# Altium schematic sheet zynq.SchDoc
size A3; SheetNumber: 2; SheetTotal: 5
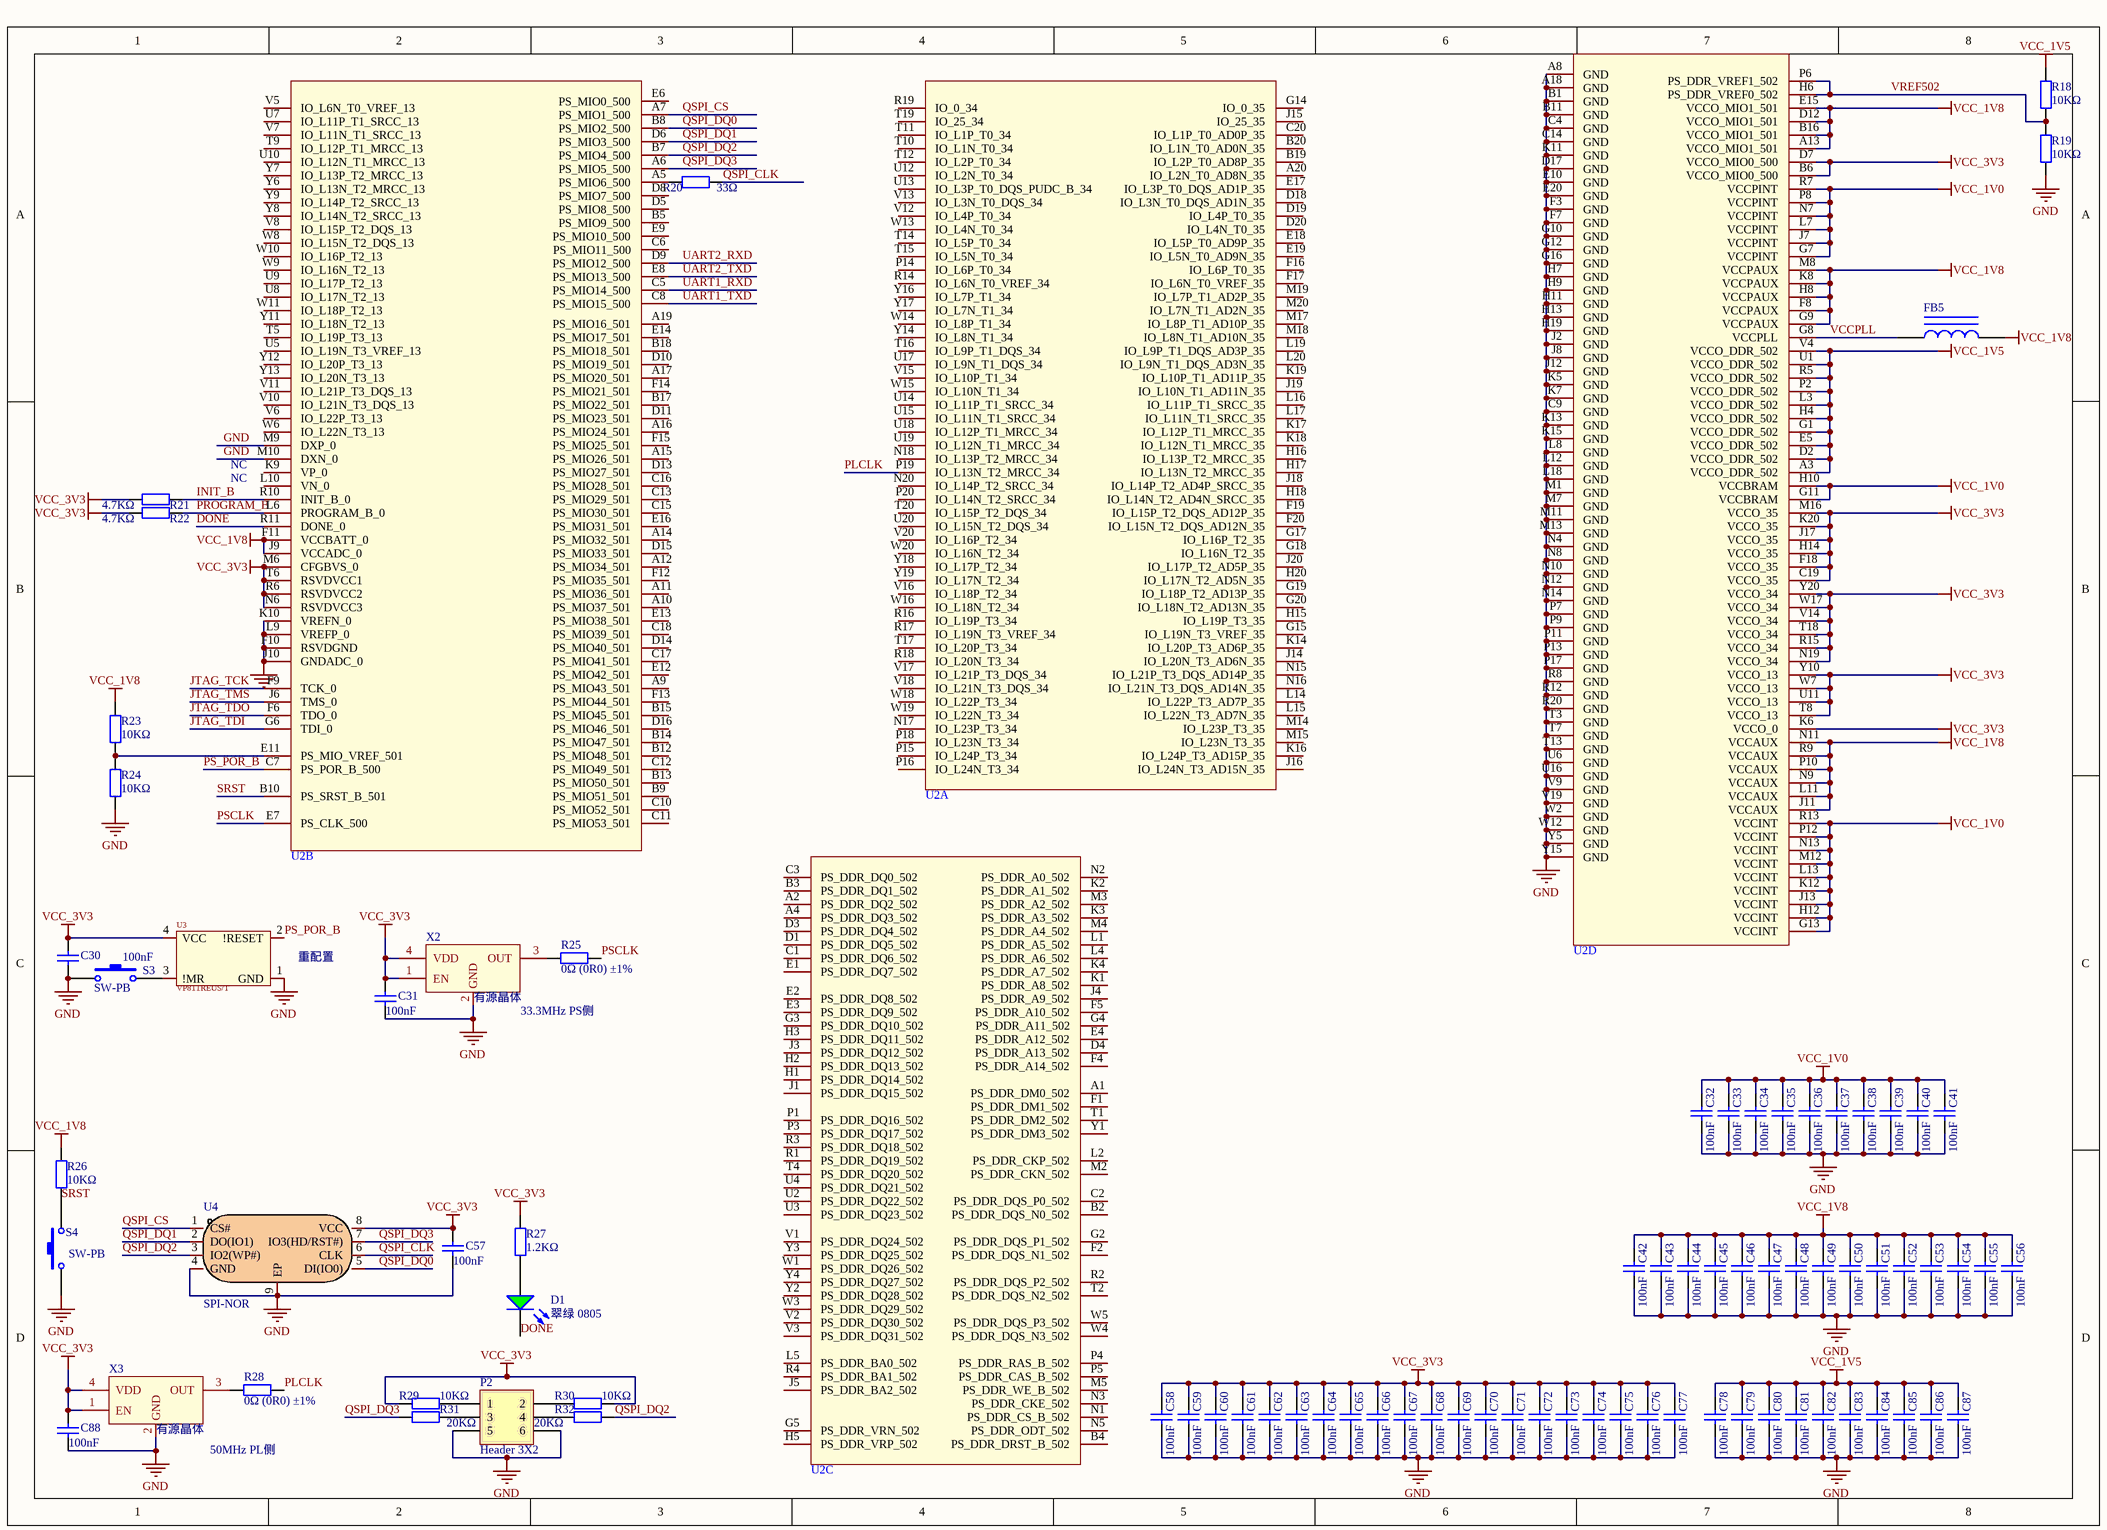
[diagram p0: zynq.SchDoc]

## Parts
C30  100nF  [0805_C]
C31  100nF  [0805_C]
C32  100nF  [0201]
C33  100nF  [0201]
C34  100nF  [0201]
C35  100nF  [0201]
C36  100nF  [0201]
C37  100nF  [0201]
C38  100nF  [0201]
C39  100nF  [0201]
C40  100nF  [0201]
C41  100nF  [0201]
C42  100nF  [0201]
C43  100nF  [0201]
C44  100nF  [0201]
C45  100nF  [0201]
C46  100nF  [0201]
C47  100nF  [0201]
C48  100nF  [0201]
C49  100nF  [0201]
C50  100nF  [0201]
C51  100nF  [0201]
C52  100nF  [0201]
C53  100nF  [0201]
C54  100nF  [0201]
C55  100nF  [0201]
C56  100nF  [0201]
C57  100nF  [0402_C]
C58  100nF  [0201]
C59  100nF  [0201]
C60  100nF  [0201]
C61  100nF  [0201]
C62  100nF  [0201]
C63  100nF  [0201]
C64  100nF  [0201]
C65  100nF  [0201]
C66  100nF  [0201]
C67  100nF  [0201]
C68  100nF  [0201]
C69  100nF  [0201]
C70  100nF  [0201]
C71  100nF  [0201]
C72  100nF  [0201]
C73  100nF  [0201]
C74  100nF  [0201]
C75  100nF  [0201]
C76  100nF  [0201]
C77  100nF  [0201]
C78  100nF  [0201]
C79  100nF  [0201]
C80  100nF  [0201]
C81  100nF  [0201]
C82  100nF  [0201]
C83  100nF  [0201]
C84  100nF  [0201]
C85  100nF  [0201]
C86  100nF  [0201]
C87  100nF  [0201]
C88  100nF  [0805_C]
D1  翠绿 0805  [0805_LED_S1]
FB5  100Ω ±25% 100MHz  [0805_L]  (value not drawn)
P2  Header 3X2  [HDR2X3]
R18  10KΩ  [0805_R]
R19  10KΩ  [0805_R]
R20  33Ω  [0402_R]
R21  4.7KΩ  [0805_R]
R22  4.7KΩ  [0805_R]
R23  10KΩ  [0805_R]
R24  10KΩ  [0805_R]
R25  0Ω (0R0) ±1%  [0805_R]
R26  10KΩ  [0805_R]
R27  1.2KΩ  [0805_R]
R28  0Ω (0R0) ±1%  [0805_R]
R29  10KΩ  [0402_R]
R30  10KΩ  [0402_R]
R31  20KΩ  [0402_R]
R32  20KΩ  [0402_R]
S3  SW-PB  [SW-3*4-2P]
S4  SW-PB  [SW-3*4-2P]
U2  XC7Z020-2CLG400I  [FBGA-400_L17.0-W17.0-R20-C20-P0.80-TL]  (value not drawn)  (parts A,B,C,D of 4)
U3  VP811REUS/T  [SOT-143_L2.9-W1.3-P1.92-LS2.3-BL]
U4  SPI-NOR  [WSON8]
X2  有源晶体  [3225]
X3  有源晶体  [3225]

## Nets
GND: C30.1 C31.1 C32.1 C33.1 C34.1 C35.1 C36.1 C37.1 C38.1 C39.1 C40.1 C41.1 C42.1 C43.1 C44.1 C45.1 C46.1 C47.1 C48.1 C49.1 C50.1 C51.1 C52.1 C53.1 C54.1 C55.1 C56.1 C57.1 C58.1 C59.1 C60.1 C61.1 C62.1 C63.1 C64.1 C65.1 C66.1 C67.1 C68.1 C69.1 C70.1 C71.1 C72.1 C73.1 C74.1 C75.1 C76.1 C77.1 C78.1 C79.1 C80.1 C81.1 C82.1 C83.1 C84.1 C85.1 C86.1 C87.1 C88.1 P2.5 P2.6 R19.1 R24.1 S3.1 S4.1 U2.A8(GND) U2.A18(GND) U2.B1(GND) U2.B11(GND) U2.C4(GND) U2.C9(GND) U2.C14(GND) U2.D17(GND) U2.E10(GND) U2.E20(GND) U2.F3(GND) U2.F7(GND) U2.F10(RSVDGND) U2.G10(GND) U2.G12(GND) U2.G16(GND) U2.H7(GND) U2.H9(GND) U2.H11(GND) U2.H13(GND) U2.H19(GND) U2.J2(GND) U2.J8(GND) U2.J10(GNDADC_0) U2.J12(GND) U2.K5(GND) U2.K7(GND) U2.K10(VREFN_0) U2.K11(GND) U2.K13(GND) U2.K15(GND) U2.L8(GND) U2.L9(VREFP_0) U2.L12(GND) U2.L18(GND) U2.M1(GND) U2.M7(GND) U2.M9(DXP_0) U2.M10(DXN_0) U2.M11(GND) U2.M13(GND) U2.N4(GND) U2.N8(GND) U2.N10(GND) U2.N12(GND) U2.N14(GND) U2.P7(GND) U2.P9(GND) U2.P11(GND) U2.P13(GND) U2.P17(GND) U2.R8(GND) U2.R12(GND) U2.R20(GND) U2.T3(GND) U2.T7(GND) U2.T13(GND) U2.U6(GND) U2.U16(GND) U2.V9(GND) U2.V19(GND) U2.W2(GND) U2.W12(GND) U2.Y5(GND) U2.Y15(GND) U3.1(GND) U4.4(GND) U4.9(EP) X2.2(GND) X3.2(GND)
VCC_1V0: C32.2 C33.2 C34.2 C35.2 C36.2 C37.2 C38.2 C39.2 C40.2 C41.2 U2.G7(VCCPINT) U2.G11(VCCBRAM) U2.G13(VCCINT) U2.H10(VCCBRAM) U2.H12(VCCINT) U2.J7(VCCPINT) U2.J13(VCCINT) U2.K12(VCCINT) U2.L7(VCCPINT) U2.L13(VCCINT) U2.M12(VCCINT) U2.N7(VCCPINT) U2.N13(VCCINT) U2.P8(VCCPINT) U2.P12(VCCINT) U2.R7(VCCPINT) U2.R13(VCCINT)
VCC_1V5: C78.2 C79.2 C80.2 C81.2 C82.2 C83.2 C84.2 C85.2 C86.2 C87.2 R18.2 U2.A3(VCCO_DDR_502) U2.D2(VCCO_DDR_502) U2.E5(VCCO_DDR_502) U2.G1(VCCO_DDR_502) U2.H4(VCCO_DDR_502) U2.L3(VCCO_DDR_502) U2.P2(VCCO_DDR_502) U2.R5(VCCO_DDR_502) U2.U1(VCCO_DDR_502) U2.V4(VCCO_DDR_502)
VCC_1V8: C42.2 C43.2 C44.2 C45.2 C46.2 C47.2 C48.2 C49.2 C50.2 C51.2 C52.2 C53.2 C54.2 C55.2 C56.2 FB5.2 R23.2 R26.2 U2.A13(VCCO_MIO1_501) U2.B16(VCCO_MIO1_501) U2.D12(VCCO_MIO1_501) U2.E15(VCCO_MIO1_501) U2.F8(VCCPAUX) U2.F11(VCCBATT_0) U2.G9(VCCPAUX) U2.H8(VCCPAUX) U2.J9(VCCADC_0) U2.J11(VCCAUX) U2.K8(VCCPAUX) U2.L11(VCCAUX) U2.M8(VCCPAUX) U2.N9(VCCAUX) U2.N11(VCCAUX) U2.P10(VCCAUX) U2.R9(VCCAUX)
VCC_3V3: C30.2 C31.2 C57.2 C58.2 C59.2 C60.2 C61.2 C62.2 C63.2 C64.2 C65.2 C66.2 C67.2 C68.2 C69.2 C70.2 C71.2 C72.2 C73.2 C74.2 C75.2 C76.2 C77.2 C88.2 R21.1 R22.1 R27.2 R29.1 R30.2 U2.B6(VCCO_MIO0_500) U2.C19(VCCO_35) U2.D7(VCCO_MIO0_500) U2.F18(VCCO_35) U2.H14(VCCO_35) U2.J17(VCCO_35) U2.K6(VCCO_0) U2.K20(VCCO_35) U2.M6(CFGBVS_0) U2.M16(VCCO_35) U2.N6(RSVDVCC3) U2.N19(VCCO_34) U2.R6(RSVDVCC2) U2.R15(VCCO_34) U2.T6(RSVDVCC1) U2.T8(VCCO_13) U2.T18(VCCO_34) U2.U11(VCCO_13) U2.V14(VCCO_34) U2.W7(VCCO_13) U2.W17(VCCO_34) U2.Y10(VCCO_13) U2.Y20(VCCO_34) U3.4(VCC) U4.8(VCC) X2.1(EN) X2.4(VDD) X3.1(EN) X3.4(VDD)
DONE: D1.K U2.R11(DONE_0)
INIT_B: R21.2 U2.R10(INIT_B_0)
JTAG_TCK: U2.F9(TCK_0)
JTAG_TDI: U2.G6(TDI_0)
JTAG_TDO: U2.F6(TDO_0)
JTAG_TMS: U2.J6(TMS_0)
PLCLK: R28.2 U2.P19(IO_L13N_T2_MRCC_34)
PROGRAM_B: R22.2 U2.L6(PROGRAM_B_0)
PS_POR_B: U2.C7(PS_POR_B_500) U3.2(!RESET)
PSCLK: R25.2 U2.E7(PS_CLK_500)
QSPI_CLK: R20.2 U4.6(CLK)
QSPI_CS: U2.A7(PS_MIO1_500) U4.1(CS#)
QSPI_DQ0: U2.B8(PS_MIO2_500) U4.5(DI(IO0))
QSPI_DQ1: U2.D6(PS_MIO3_500) U4.2(DO(IO1))
QSPI_DQ2: R32.2 U2.B7(PS_MIO4_500) U4.3(IO2(WP#))
QSPI_DQ3: R31.1 U2.A6(PS_MIO5_500) U4.7(IO3(HD/RST#))
SRST: R26.1 S4.2 U2.B10(PS_SRST_B_501)
UART1_RXD: U2.C5(PS_MIO14_500)
UART1_TXD: U2.C8(PS_MIO15_500)
UART2_RXD: U2.D9(PS_MIO12_500)
UART2_TXD: U2.E8(PS_MIO13_500)
VCCPLL: FB5.1 U2.G8(VCCPLL)
VREF502: R18.1 R19.2 U2.H6(PS_DDR_VREF0_502) U2.P6(PS_DDR_VREF1_502)
NetD1_A: D1.A R27.1
NetP2_1: P2.1 R29.2
NetP2_2: P2.2 R30.1
NetP2_3: P2.3 R31.2
NetP2_4: P2.4 R32.1
NetR20_1: R20.1 U2.A5(PS_MIO6_500)
NetR23_1: R23.1 R24.2 U2.E11(PS_MIO_VREF_501)
NetR25_1: R25.1 X2.3(OUT)
NetR28_1: R28.1 X3.3(OUT)
NetS3_2: S3.2 U3.3(!MR)

Not connected (* = marked no-connect by the designer): U2 A1(PS_DDR_DM0_502) A2(PS_DDR_DQ2_502) A4(PS_DDR_DQ3_502) A9(PS_MIO43_501) A10(PS_MIO37_501) A11(PS_MIO36_501) A12(PS_MIO34_501) A14(PS_MIO32_501) A15(PS_MIO26_501) A16(PS_MIO24_501) A17(PS_MIO20_501) A19(PS_MIO16_501) A20(IO_L2N_T0_AD8N_35) B2(PS_DDR_DQS_N0_502) B3(PS_DDR_DQ1_502) B4(PS_DDR_DRST_B_502) B5(PS_MIO9_500) B9(PS_MIO51_501) B12(PS_MIO48_501) B13(PS_MIO50_501) B14(PS_MIO47_501) B15(PS_MIO45_501) B17(PS_MIO22_501) B18(PS_MIO18_501) B19(IO_L2P_T0_AD8P_35) B20(IO_L1N_T0_AD0N_35) C1(PS_DDR_DQ6_502) C2(PS_DDR_DQS_P0_502) C3(PS_DDR_DQ0_502) C6(PS_MIO11_500) C10(PS_MIO52_501) C11(PS_MIO53_501) C12(PS_MIO49_501) C13(PS_MIO29_501) C15(PS_MIO30_501) C16(PS_MIO28_501) C17(PS_MIO41_501) C18(PS_MIO39_501) C20(IO_L1P_T0_AD0P_35) D1(PS_DDR_DQ5_502) D3(PS_DDR_DQ4_502) D4(PS_DDR_A13_502) D5(PS_MIO8_500) D8(PS_MIO7_500) D10(PS_MIO19_501) D11(PS_MIO23_501) D13(PS_MIO27_501) D14(PS_MIO40_501) D15(PS_MIO33_501) D16(PS_MIO46_501) D18(IO_L3N_T0_DQS_AD1N_35) D19(IO_L4P_T0_35) D20(IO_L4N_T0_35) E1(PS_DDR_DQ7_502) E2(PS_DDR_DQ8_502) E3(PS_DDR_DQ9_502) E4(PS_DDR_A12_502) E6(PS_MIO0_500) E9(PS_MIO10_500) E12(PS_MIO42_501) E13(PS_MIO38_501) E14(PS_MIO17_501) E16(PS_MIO31_501) E17(IO_L3P_T0_DQS_AD1P_35) E18(IO_L5P_T0_AD9P_35) E19(IO_L5N_T0_AD9N_35) F1(PS_DDR_DM1_502) F2(PS_DDR_DQS_N1_502) F4(PS_DDR_A14_502) F5(PS_DDR_A10_502) F12(PS_MIO35_501) F13(PS_MIO44_501) F14(PS_MIO21_501) F15(PS_MIO25_501) F16(IO_L6P_T0_35) F17(IO_L6N_T0_VREF_35) F19(IO_L15P_T2_DQS_AD12P_35) F20(IO_L15N_T2_DQS_AD12N_35) G2(PS_DDR_DQS_P1_502) G3(PS_DDR_DQ10_502) G4(PS_DDR_A11_502) G5(PS_DDR_VRN_502) G14(IO_0_35) G15(IO_L19N_T3_VREF_35) G17(IO_L16P_T2_35) G18(IO_L16N_T2_35) G19(IO_L18P_T2_AD13P_35) G20(IO_L18N_T2_AD13N_35) H1(PS_DDR_DQ14_502) H2(PS_DDR_DQ13_502) H3(PS_DDR_DQ11_502) H5(PS_DDR_VRP_502) H15(IO_L19P_T3_35) H16(IO_L13P_T2_MRCC_35) H17(IO_L13N_T2_MRCC_35) H18(IO_L14N_T2_AD4N_SRCC_35) H20(IO_L17N_T2_AD5N_35) J1(PS_DDR_DQ15_502) J3(PS_DDR_DQ12_502) J4(PS_DDR_A9_502) J5(PS_DDR_BA2_502) J14(IO_L20N_T3_AD6N_35) J15(IO_25_35) J16(IO_L24N_T3_AD15N_35) J18(IO_L14P_T2_AD4P_SRCC_35) J19(IO_L10N_T1_AD11N_35) J20(IO_L17P_T2_AD5P_35) K1(PS_DDR_A8_502) K2(PS_DDR_A1_502) K3(PS_DDR_A3_502) K4(PS_DDR_A7_502) K9(VP_0) K14(IO_L20P_T3_AD6P_35) K16(IO_L24P_T3_AD15P_35) K17(IO_L12P_T1_MRCC_35) K18(IO_L12N_T1_MRCC_35) K19(IO_L10P_T1_AD11P_35) L1(PS_DDR_A5_502) L2(PS_DDR_CKP_502) L4(PS_DDR_A6_502) L5(PS_DDR_BA0_502) L10(VN_0) L14(IO_L22P_T3_AD7P_35) L15(IO_L22N_T3_AD7N_35) L16(IO_L11P_T1_SRCC_35) L17(IO_L11N_T1_SRCC_35) L19(IO_L9P_T1_DQS_AD3P_35) L20(IO_L9N_T1_DQS_AD3N_35) M2(PS_DDR_CKN_502) M3(PS_DDR_A2_502) M4(PS_DDR_A4_502) M5(PS_DDR_WE_B_502) M14(IO_L23P_T3_35) M15(IO_L23N_T3_35) M17(IO_L8P_T1_AD10P_35) M18(IO_L8N_T1_AD10N_35) M19(IO_L7P_T1_AD2P_35) M20(IO_L7N_T1_AD2N_35) N1(PS_DDR_CS_B_502) N2(PS_DDR_A0_502) N3(PS_DDR_CKE_502) N5(PS_DDR_ODT_502) N15(IO_L21P_T3_DQS_AD14P_35) N16(IO_L21N_T3_DQS_AD14N_35) N17(IO_L23P_T3_34) N18(IO_L13P_T2_MRCC_34) N20(IO_L14P_T2_SRCC_34) P1(PS_DDR_DQ16_502) P3(PS_DDR_DQ17_502) P4(PS_DDR_RAS_B_502) P5(PS_DDR_CAS_B_502) P14(IO_L6P_T0_34) P15(IO_L24P_T3_34) P16(IO_L24N_T3_34) P18(IO_L23N_T3_34) P20(IO_L14N_T2_SRCC_34) R1(PS_DDR_DQ19_502) R2(PS_DDR_DQS_P2_502) R3(PS_DDR_DQ18_502) R4(PS_DDR_BA1_502) R14(IO_L6N_T0_VREF_34) R16(IO_L19P_T3_34) R17(IO_L19N_T3_VREF_34) R18(IO_L20N_T3_34) R19(IO_0_34) T1(PS_DDR_DM2_502) T2(PS_DDR_DQS_N2_502) T4(PS_DDR_DQ20_502) T5(IO_L19P_T3_13) T9(IO_L12P_T1_MRCC_13) T10(IO_L1N_T0_34) T11(IO_L1P_T0_34) T12(IO_L2P_T0_34) T14(IO_L5P_T0_34) T15(IO_L5N_T0_34) T16(IO_L9P_T1_DQS_34) T17(IO_L20P_T3_34) T19(IO_25_34) T20(IO_L15P_T2_DQS_34) U2(PS_DDR_DQ22_502) U3(PS_DDR_DQ23_502) U4(PS_DDR_DQ21_502) U5(IO_L19N_T3_VREF_13) U7(IO_L11P_T1_SRCC_13) U8(IO_L17N_T2_13) U9(IO_L17P_T2_13) U10(IO_L12N_T1_MRCC_13) U12(IO_L2N_T0_34) U13(IO_L3P_T0_DQS_PUDC_B_34) U14(IO_L11P_T1_SRCC_34) U15(IO_L11N_T1_SRCC_34) U17(IO_L9N_T1_DQS_34) U18(IO_L12P_T1_MRCC_34) U19(IO_L12N_T1_MRCC_34) U20(IO_L15N_T2_DQS_34) V1(PS_DDR_DQ24_502) V2(PS_DDR_DQ30_502) V3(PS_DDR_DQ31_502) V5(IO_L6N_T0_VREF_13) V6(IO_L22P_T3_13) V7(IO_L11N_T1_SRCC_13) V8(IO_L15P_T2_DQS_13) V10(IO_L21N_T3_DQS_13) V11(IO_L21P_T3_DQS_13) V12(IO_L4P_T0_34) V13(IO_L3N_T0_DQS_34) V15(IO_L10P_T1_34) V16(IO_L18P_T2_34) V17(IO_L21P_T3_DQS_34) V18(IO_L21N_T3_DQS_34) V20(IO_L16P_T2_34) W1(PS_DDR_DQ26_502) W3(PS_DDR_DQ29_502) W4(PS_DDR_DQS_N3_502) W5(PS_DDR_DQS_P3_502) W6(IO_L22N_T3_13) W8(IO_L15N_T2_DQS_13) W9(IO_L16N_T2_13) W10(IO_L16P_T2_13) W11(IO_L18P_T2_13) W13(IO_L4N_T0_34) W14(IO_L8P_T1_34) W15(IO_L10N_T1_34) W16(IO_L18N_T2_34) W18(IO_L22P_T3_34) W19(IO_L22N_T3_34) W20(IO_L16N_T2_34) Y1(PS_DDR_DM3_502) Y2(PS_DDR_DQ28_502) Y3(PS_DDR_DQ25_502) Y4(PS_DDR_DQ27_502) Y6(IO_L13N_T2_MRCC_13) Y7(IO_L13P_T2_MRCC_13) Y8(IO_L14N_T2_SRCC_13) Y9(IO_L14P_T2_SRCC_13) Y11(IO_L18N_T2_13) Y12(IO_L20P_T3_13) Y13(IO_L20N_T3_13) Y14(IO_L8N_T1_34) Y16(IO_L7P_T1_34) Y17(IO_L7N_T1_34) Y18(IO_L17P_T2_34) Y19(IO_L17N_T2_34)

## Notes on the sheet
- NC
- (near U3) 重配置
- (near X2) 33.3MHz PS侧
- (near X3) 50MHz PL侧

## Library data of the parts
C30-C88 = 0402 100nF (104) 10% 16V: 贴片电容; ComponentLink1Description: 供应商链接; ComponentLink1URL: http://www.szlcsc.com/product/details_1877.html; Package: 0402; Supplier: LC; SuppliersPartNumber: C1525
D1 = 0805 翠绿: 发光二极管; ComponentLink1Description: 供应商链接; ComponentLink1URL: http://www.szlcsc.com/product/details_2670.html; Package: 0805; Supplier: LC; SuppliersPartNumber: C2297
FB5 = 0805 100Ω 25% 100MHz: 贴片磁珠; ComponentLink1Description: 供应商链接; ComponentLink1URL: http://www.szlcsc.com/product/details_1367.html; Package: 0805; Supplier: LC; SuppliersPartNumber: C1015
P2 = Header 3X2: Header, 3-Pin, Dual row; LatestRevisionDate: 17-Jul-2002; LatestRevisionNote: Re-released for DXP Platform.; Publisher: Altium Limited
R18 R19 R23 R24 = 0805 10KΩ (1002) 1%: 贴片电阻; ComponentLink1Description: 供应商链接; ComponentLink1URL: http://www.szlcsc.com/product/details_18102.html; Package: 0805; Supplier: LC; SuppliersPartNumber: C17414
R20 = 0402 33Ω (33R0) 1%: 贴片电阻; ComponentLink1Description: 供应商链接; ComponentLink1URL: http://www.szlcsc.com/product/details_25848.html; Package: 0402; Supplier: LC; SuppliersPartNumber: C25105
R21 R22 = 0402 4.7KΩ (4701) 1%: 贴片电阻; ComponentLink1Description: 供应商链接; ComponentLink1URL: http://www.szlcsc.com/product/details_26643.html; Package: 0402; Supplier: LC; SuppliersPartNumber: C25900
R25 R28 = 0805 0Ω (0R0) 1%: 贴片电阻; ComponentLink1Description: 供应商链接; ComponentLink1URL: http://www.szlcsc.com/product/details_18165.html; Package: 0805; Supplier: LC; SuppliersPartNumber: C17477
R26 R29 R30 = 0402 10KΩ (1002) 1%: 贴片电阻; ComponentLink1Description: 供应商链接; ComponentLink1URL: http://www.szlcsc.com/product/details_26487.html; Package: 0402; Supplier: LC; SuppliersPartNumber: C25744
R27 = 0805 1.2KΩ (1201) 1%: 贴片电阻; ComponentLink1Description: 供应商链接; ComponentLink1URL: http://www.szlcsc.com/product/details_18067.html; Package: 0805; Supplier: LC; SuppliersPartNumber: C17379
R31 R32 = 0402 20KΩ (2002) 1%: 贴片电阻; ComponentLink1Description: 供应商链接; ComponentLink1URL: http://www.szlcsc.com/product/details_26508.html; Package: 0402; Supplier: LC; SuppliersPartNumber: C25765
S3 S4 = SW-PB: Switch; Published: 24-Mar-1999; LatestRevisionDate: 17-Jul-2002; LatestRevisionNote: Re-released for DXP Platform.; PackageReference: SPST-2; Publisher: Altium Limited; PackageDescription: Switch; 2 Leads
U2 = XC7Z020-2CLG400I: Manufacturer: XILINX(赛灵思); Convert to PCB: yes; Symbol: XC7Z020-2CLG400I; Device: XC7Z020-2CLG400I; Add into BOM: yes; Supplier: LCSC; Supplier Part: C569043; Supplier Footprint: CSPBGA-400; JLCPCB Part Class: 扩展库; LCSC Part Name: -; Datasheet: https://atta.szlcsc.com/upload/public/pdf/source/20191108/C446028_7ED8319F1F88212BA1E5D387DA4ECDB9.pdf; Manufacturer Part: XC7Z020-2CLG400I
U3 = VP811REUS/T: 复位电平管理芯片; Manufacturer: VP(中芯集成); Add into BOM: yes; ChipType: 电源监控器; Output Type: 开漏; Reset Active Level: 低电平有效; Number of Voltages Monitored: 1; Manual Reset: 有; Watchdog: 无; Symbol: VP811REUS/T; Device: VP811REUS/T; LCSC Part Name: VP811REUS/T; Supplier Part: C381485; Manufacturer Part: VP811REUS/T; Supplier Footprint: SOT-143; JLCPCB Part Class: Extended Part; Datasheet: https://atta.szlcsc.com/upload/public/pdf/source/20190322/C381486_AD49D5EAA1071F589CB38927003B9E48.pdf; Supplier: LCSC; Convert to PCB: yes; Operating Temperature: -40℃~+125℃@(Tj)
U4 = W25Q64: NOR FLASH
X2 X3 = 有源晶体: 有源晶振